# Altium project PCB_main.PrjPcb
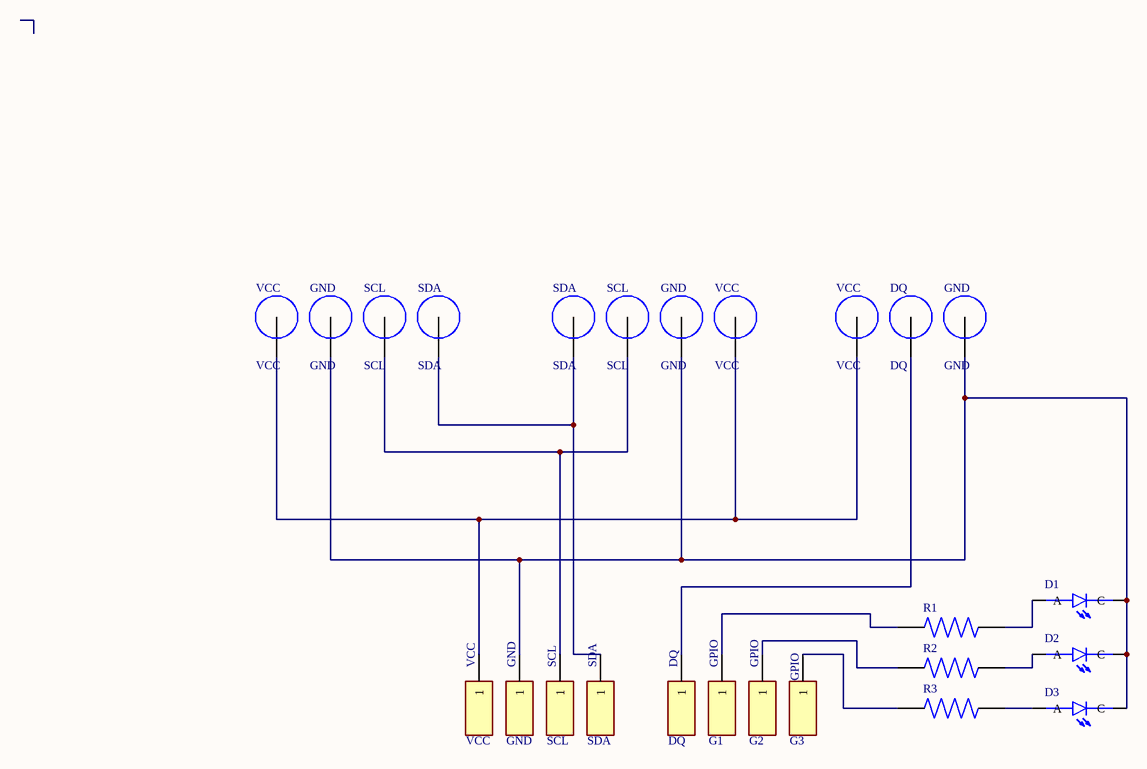
[diagram p0: Sheet1.SchDoc]
1 sheet, 25 parts. Net scope: global (net labels, ports and power ports of the same name join across sheets).
Board file: PCB1.PcbDoc

## Sheet Sheet1.SchDoc
size A4; SheetNumber: 1; SheetTotal: 1

### Parts
(Parts that share a designator on the sheet are numbered #1, #2 ... from top to bottom, then left to right.)
D1  WP7113ID  [LED_WP7113ID]  (value not drawn)
D2  WP7113ID  [LED_WP7113ID]  (value not drawn)
D3  WP7113ID  [LED_WP7113ID]  (value not drawn)
DQ#1  DQ  [Pad_pcb]
DQ#2  TS-101-X-A-1  [SAMTEC_TS-101-X-A-1]  (value not drawn)
G1  TS-101-X-A-1  [SAMTEC_TS-101-X-A-1]  (value not drawn)
G2  TS-101-X-A-1  [SAMTEC_TS-101-X-A-1]  (value not drawn)
G3  TS-101-X-A-1  [SAMTEC_TS-101-X-A-1]  (value not drawn)
GND#1  GND  [Pad_pcb]
GND#2  GND  [Pad_pcb]
GND#3  GND  [Pad_pcb]
GND#4  TS-101-X-A-1  [SAMTEC_TS-101-X-A-1]  (value not drawn)
R1  ERJU02F3600X  [RES_ERJU02F3600X]  (value not drawn)
R2  ERJU02F3600X  [RES_ERJU02F3600X]  (value not drawn)
R3  ERJU02F3600X  [RES_ERJU02F3600X]  (value not drawn)
SCL#1  SCL  [Pad_pcb]
SCL#2  SCL  [Pad_pcb]
SCL#3  TS-101-X-A-1  [SAMTEC_TS-101-X-A-1]  (value not drawn)
SDA#1  SDA  [Pad_pcb]
SDA#2  SDA  [Pad_pcb]
SDA#3  TS-101-X-A-1  [SAMTEC_TS-101-X-A-1]  (value not drawn)
VCC#1  VCC  [Pad_pcb]
VCC#2  VCC  [Pad_pcb]
VCC#3  VCC  [Pad_pcb]
VCC#4  TS-101-X-A-1  [SAMTEC_TS-101-X-A-1]  (value not drawn)

### Nets
NetD1_A: D1.A R1.2
NetD1_C: D1.C D2.C D3.C GND#1.1(Pad) GND#2.1(Pad) GND#3.1(Pad) GND#4.1
NetD2_A: D2.A R2.2
NetD3_A: D3.A R3.2
NetDQ#1_1: DQ#1.1(Pad) DQ#2.1
NetG1_1: G1.1 R1.1
NetG2_1: G2.1 R2.1
NetG3_1: G3.1 R3.1
NetSCL#1_1: SCL#1.1(Pad) SCL#2.1(Pad) SCL#3.1
NetSDA#1_1: SDA#1.1(Pad) SDA#2.1(Pad) SDA#3.1
NetVCC#1_1: VCC#1.1(Pad) VCC#2.1(Pad) VCC#3.1(Pad) VCC#4.1

### Notes on the sheet
- (near VCC#4) VCC
- (near GND#4) GND
- (near SCL#3) SCL
- (near SDA#3) SDA
- (near DQ#2) DQ
- (near G1) GPIO
- (near G2) GPIO
- (near G3) GPIO

### Library data of the parts
D1-D3 = WP7113ID: Red 617nm LED Indication - Discrete 2V Radial; MF: Kingbright; Price: None; MP: WP7113ID; Package: Radial Kingbright; Check_prices: https://www.snapeda.com/parts/WP7113ID/Kingbright/view-part/?ref=eda; Purchase-URL: https://pricing.snapeda.com/search/part/WP7113ID/?ref=eda; Availability: In Stock; Value: *; SnapEDA_Link: https://www.snapeda.com/parts/WP7113ID/Kingbright/view-part/?ref=snap
DQ#1 GND#1-GND#3 SCL#1 SCL#2 SDA#1 SDA#2 VCC#1-VCC#3 = Pad
DQ#2 G1-G3 GND#4 SCL#3 SDA#3 VCC#4 = TS-101-X-A-1: 1 Position Header Connector Male Pin Gold; MF: Samtec Inc.; MP: TS-101-G-A-1; SnapEDA_Link: https://www.snapeda.com/parts/TS-101-G-A-1/Samtec+Inc./view-part/?ref=snap; Package: None; Value: *; Check_prices: https://www.snapeda.com/parts/TS-101-G-A-1/Samtec+Inc./view-part/?ref=eda
R1-R3 = ERJU02F3600X: Price: None; Value: *; MP: ERJU02F3600X; Package: None; Availability: Unavailable